# EAGLE schematic INVERTER (EAGLE 7.5.0)
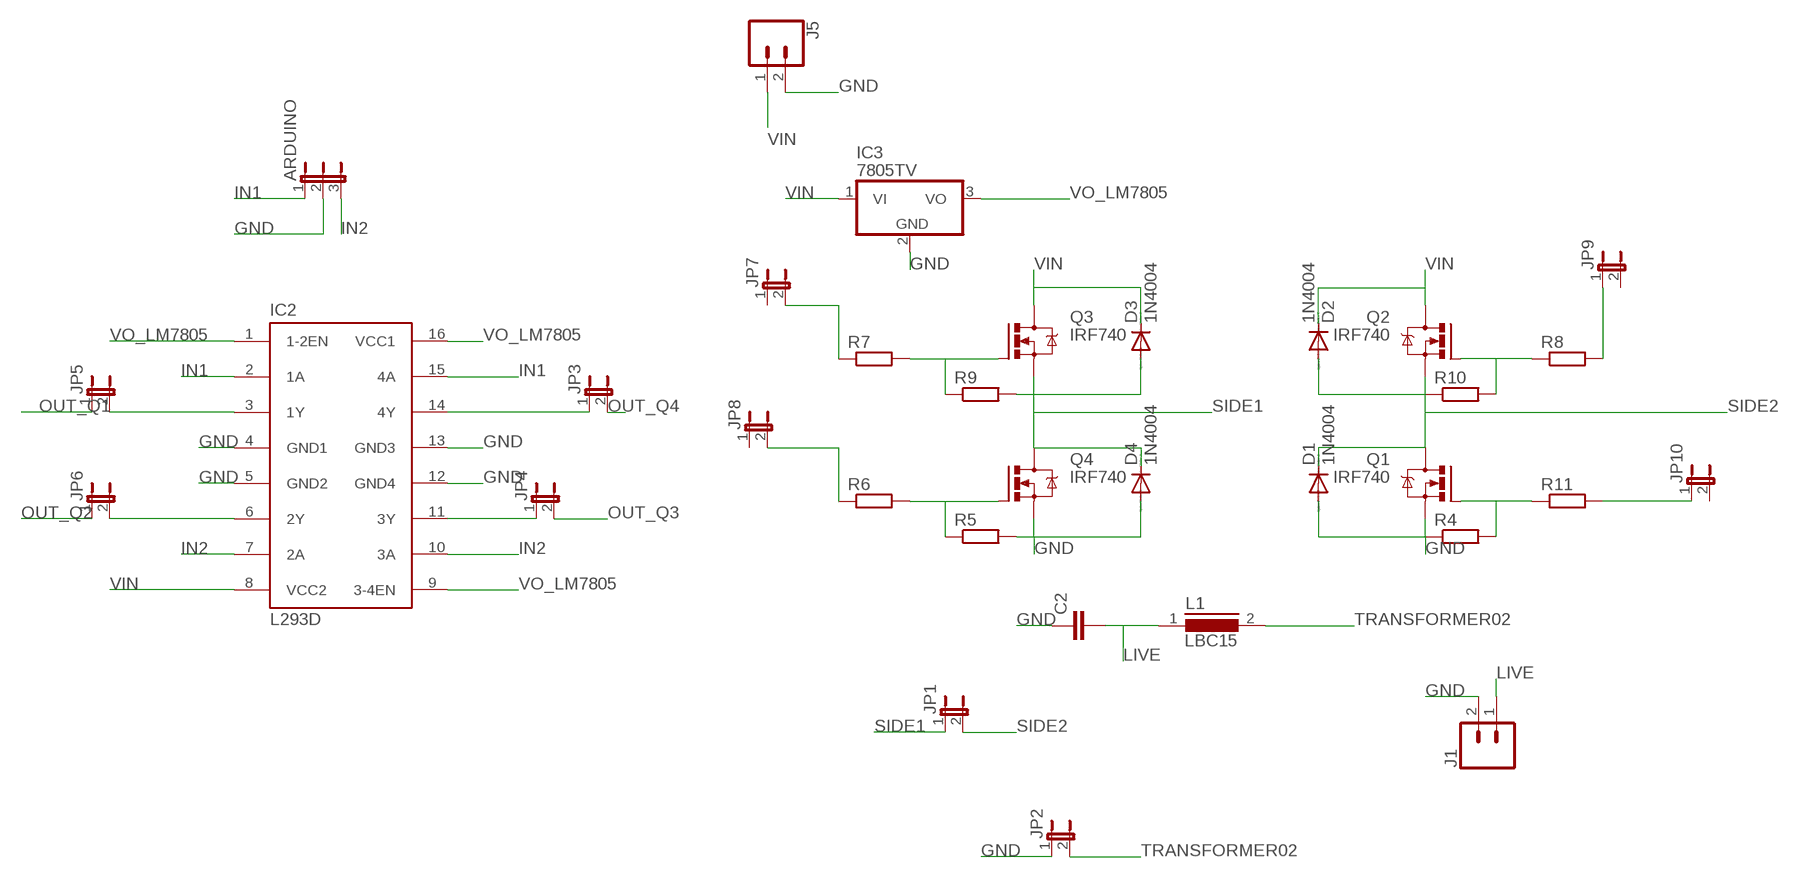
[diagram p0: schematic, sheet 1]

## Parts
ARDUINO  JP2E  [JP2]
C2  C5/5.5  [C5B5.5]
D1  1N4004  [DO41-10]
D2  1N4004  [DO41-10]
D3  1N4004  [DO41-10]
D4  1N4004  [DO41-10]
IC2  L293D  [DIL16]
IC3  7805TV  [TO220V]
J1  CONN_02PTH4  [1X02_XTRA_BIG]
J5  CONN_02PTH4  [1X02_XTRA_BIG]
JP1  JP1E  [JP1]
JP2  JP1E  [JP1]
JP3  JP1E  [JP1]
JP4  JP1E  [JP1]
JP5  JP1E  [JP1]
JP6  JP1E  [JP1]
JP7  JP1E  [JP1]
JP8  JP1E  [JP1]
JP9  JP1E  [JP1]
JP10  JP1E  [JP1]
L1  LBC15  [LBC15]
Q1  IRF740  [TO220BV]
Q2  IRF740  [TO220BV]
Q3  IRF740  [TO220BV]
Q4  IRF740  [TO220BV]
R4  R-EU_VMTA55  [VMTA55]
R5  R-EU_VMTA55  [VMTA55]
R6  R-EU_VMTA55  [VMTA55]
R7  R-EU_VMTA55  [VMTA55]
R8  R-EU_VMTA55  [VMTA55]
R9  R-EU_VMTA55  [VMTA55]
R10  R-EU_VMTA55  [VMTA55]
R11  R-EU_VMTA55  [VMTA55]

## Nets
GND: ARDUINO.2 C2.1 D1.A D4.A IC2.4(GND1) IC2.5(GND2) IC2.12(GND4) IC2.13(GND3) IC3.2(GND) J1.2 J5.2 JP2.1 Q1.S Q4.S R4.1 R5.2
IN1: ARDUINO.1 IC2.2(1A) IC2.15(4A)
IN2: ARDUINO.3 IC2.7(2A) IC2.10(3A)
LIVE: C2.2 J1.1 L1.1
N$2: IC2.3(1Y) JP5.2
N$3: IC2.6(2Y) JP6.2
N$4: Q2.G R8.1 R10.2
N$5: Q1.G R4.2 R11.1
N$6: JP7.2 R7.1
N$7: IC2.11(3Y) JP4.1
N$8: Q4.G R5.1 R6.2
N$9: Q3.G R7.2 R9.1
N$10: JP8.2 R6.1
N$11: JP9.1 R8.2
N$12: JP10.1 R11.2
N$15: IC2.14(4Y) JP3.1
OUT_Q1: JP5.1
OUT_Q2: JP6.1
OUT_Q3: JP4.2
OUT_Q4: JP3.2
SIDE1: D3.A D4.C JP1.1 Q3.S Q4.D R9.2
SIDE2: D1.C D2.A JP1.2 Q1.D Q2.S R10.1
TRANSFORMER02: JP2.2 L1.2
VIN: D2.C D3.C IC2.8(VCC2) IC3.1(VI) J5.1 Q2.D Q3.D
VO_LM7805: IC2.1(1-2EN) IC2.9(3-4EN) IC2.16(VCC1) IC3.3(VO)
Unconnected: JP7.1 JP8.1 JP9.2 JP10.2

## Library data of the parts
ARDUINO = jumper:JP2E: JUMPER
C2 = capacitor-wima:C: CAPACITOR naming: grid - package width
D1-D4 = diode:1N4004: DIODE general purpose rectifier, 1 A
IC2 = st-microelectronics:L293D: PUSH-PULL 4 CHANNEL DRIVER; MPN: L293D; OC_FARNELL: 9589619; OC_NEWARK: 56P8249
IC3 = linear:78*: Positive VOLTAGE REGULATOR Source: http://cache.national.com/ds/LM/LM78L05.pdf http://www.fairchildsemi.com/ds/LM/LM7805.pdf
J1 J5 = SparkFun-Connectors:CONN_02: Multi connection point. Often used as Generic Header-pin footprint for 0.1 inch spaced/style header connections On any of the 0.1 inch spaced packages, you can populate with these: Break Away Headers - Straight <https://www.sparkfun.com/products/116> (PRT-00116) Break Away Male Headers - Right Angle <https://www.sparkfun.com/products/553> (PRT-00553) Female Headers <https://www.sparkfun.com/products/115> (PRT-00115) Break Away Headers - Machine Pin <https://www.sparkfun.com/products/117> (PRT-00117) Break Away Female Headers - Swiss Machine Pin <https://www.sparkfun.com/products/743> (PRT-00743) For SCREWTERMINALS and SPRING TERMINALS visit here: Screw Terimnals on SparkFun.com <https://www.sparkfun.com/search/results?term=Screw+Terminals> (5mm/3.5mm/2.54mm spacing) This device is also useful as a general connection point to wire up your design to another part of your project. Our various solder wires solder well into these plated through hole pads. Hook-Up Wire - Assortment (Stranded, 22 AWG) <https://www.sparkfun.com/products/11375> (PRT-11375) Hook-Up Wire - Assortment (Solid Core, 22 AWG) <https://www.sparkfun.com/products/11367> (PRT-11367) View the entire wire category on our website here <https://www.sparkfun.com/categories/141> Special notes: Molex polarized connector foot print use with: PRT-08233 with associated crimp pins and housings. 2.54_SCREWTERM for use with PRT-10571. 3.5mm Screw Terminal footprints for PRT-08084 5mm Screw Terminal footprints for use with PRT-08432
JP1-JP10 = jumper:JP1E: JUMPER
L1 = inductors:LBC15: INDUCTOR
Q1-Q4 = transistor-power:IRF740: N-CHANNEL MOS FET
R4-R11 = rcl:R-EU_: RESISTOR, European symbol